# EAGLE design L298N (EAGLE 6.1)
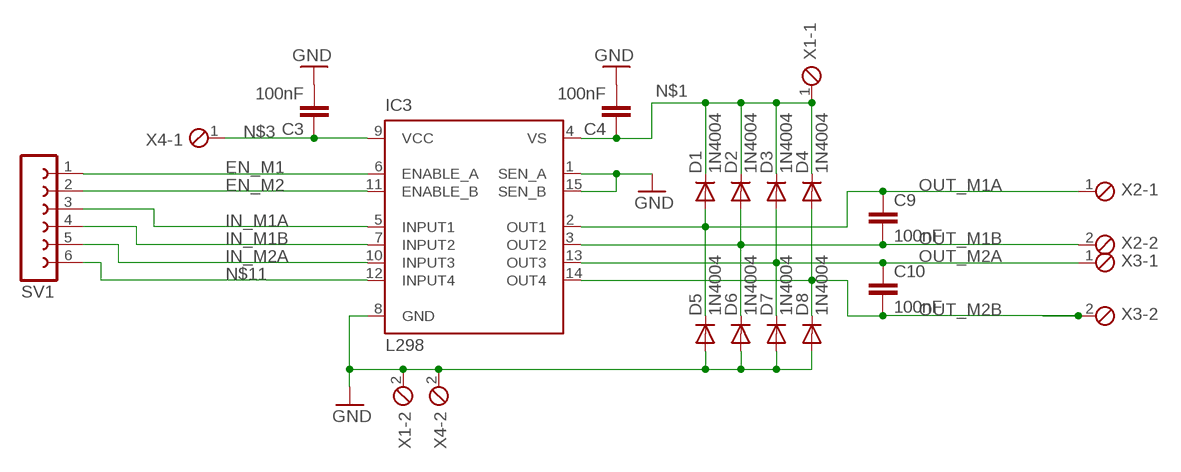
[diagram p0: schematic, sheet 1]

## Parts
C3  100nF  C-EU050-050X075  [C050-050X075]
C4  100nF  C-EU050-050X075  [C050-050X075]
C9  100nF  C-EU050-050X075  [C050-050X075]
C10  100nF  C-EU050-050X075  [C050-050X075]
D1  1N4004  [DO41-10]
D2  1N4004  [DO41-10]
D3  1N4004  [DO41-10]
D4  1N4004  [DO41-10]
D5  1N4004  [DO41-10]
D6  1N4004  [DO41-10]
D7  1N4004  [DO41-10]
D8  1N4004  [DO41-10]
IC3  L298  [MULTIWATT-15]
SV1  FE06-1  [FE06]
X1  MPT2  [2POL254]
X2  MPT2  [2POL254]
X3  MPT2  [2POL254]
X4  MPT2  [2POL254]

## Nets
EN_M1: IC3.6(ENABLE_A) SV1.1
EN_M2: IC3.11(ENABLE_B) SV1.2
GND: C3.2 C4.2 D5.A D6.A D7.A D8.A IC3.1(SEN_A) IC3.8(GND) IC3.15(SEN_B) X1.2 X4.2
IN_M1A: IC3.5(INPUT1) SV1.3
IN_M1B: IC3.7(INPUT2) SV1.4
IN_M2A: IC3.10(INPUT3) SV1.5
N$1: C4.1 D1.C D2.C D3.C D4.C IC3.4(VS) X1.1
N$3: C3.1 IC3.9(VCC) X4.1
N$11: IC3.12(INPUT4) SV1.6
OUT_M1A: C9.1 D1.A D5.C IC3.2(OUT1) X2.1
OUT_M1B: C9.2 D2.A D6.C IC3.3(OUT2) X2.2
OUT_M2A: C10.1 D3.A D7.C IC3.13(OUT3) X3.1
OUT_M2B: C10.2 D4.A D8.C IC3.14(OUT4) X3.2

## Library data of the parts
C3 C4 C9 C10 = resistor:C-EU: CAPACITOR, European symbol
D1-D8 = diode:1N4004: DIODE general purpose rectifier, 1 A
IC3 = st-microelectronics:L298: DUAL FULL-BRIDGE DRIVER; MPN: L298N; OC_FARNELL: 1589425; OC_NEWARK: 32M1527
SV1 = con-lsta:FE06-1: FEMALE HEADER; OC_FARNELL: unknown; OC_NEWARK: unknown
X1-X4 = con-phoenix-254:MPT2: PHOENIX CONNECTOR; OC_FARNELL: unknown; OC_NEWARK: unknown

## Board
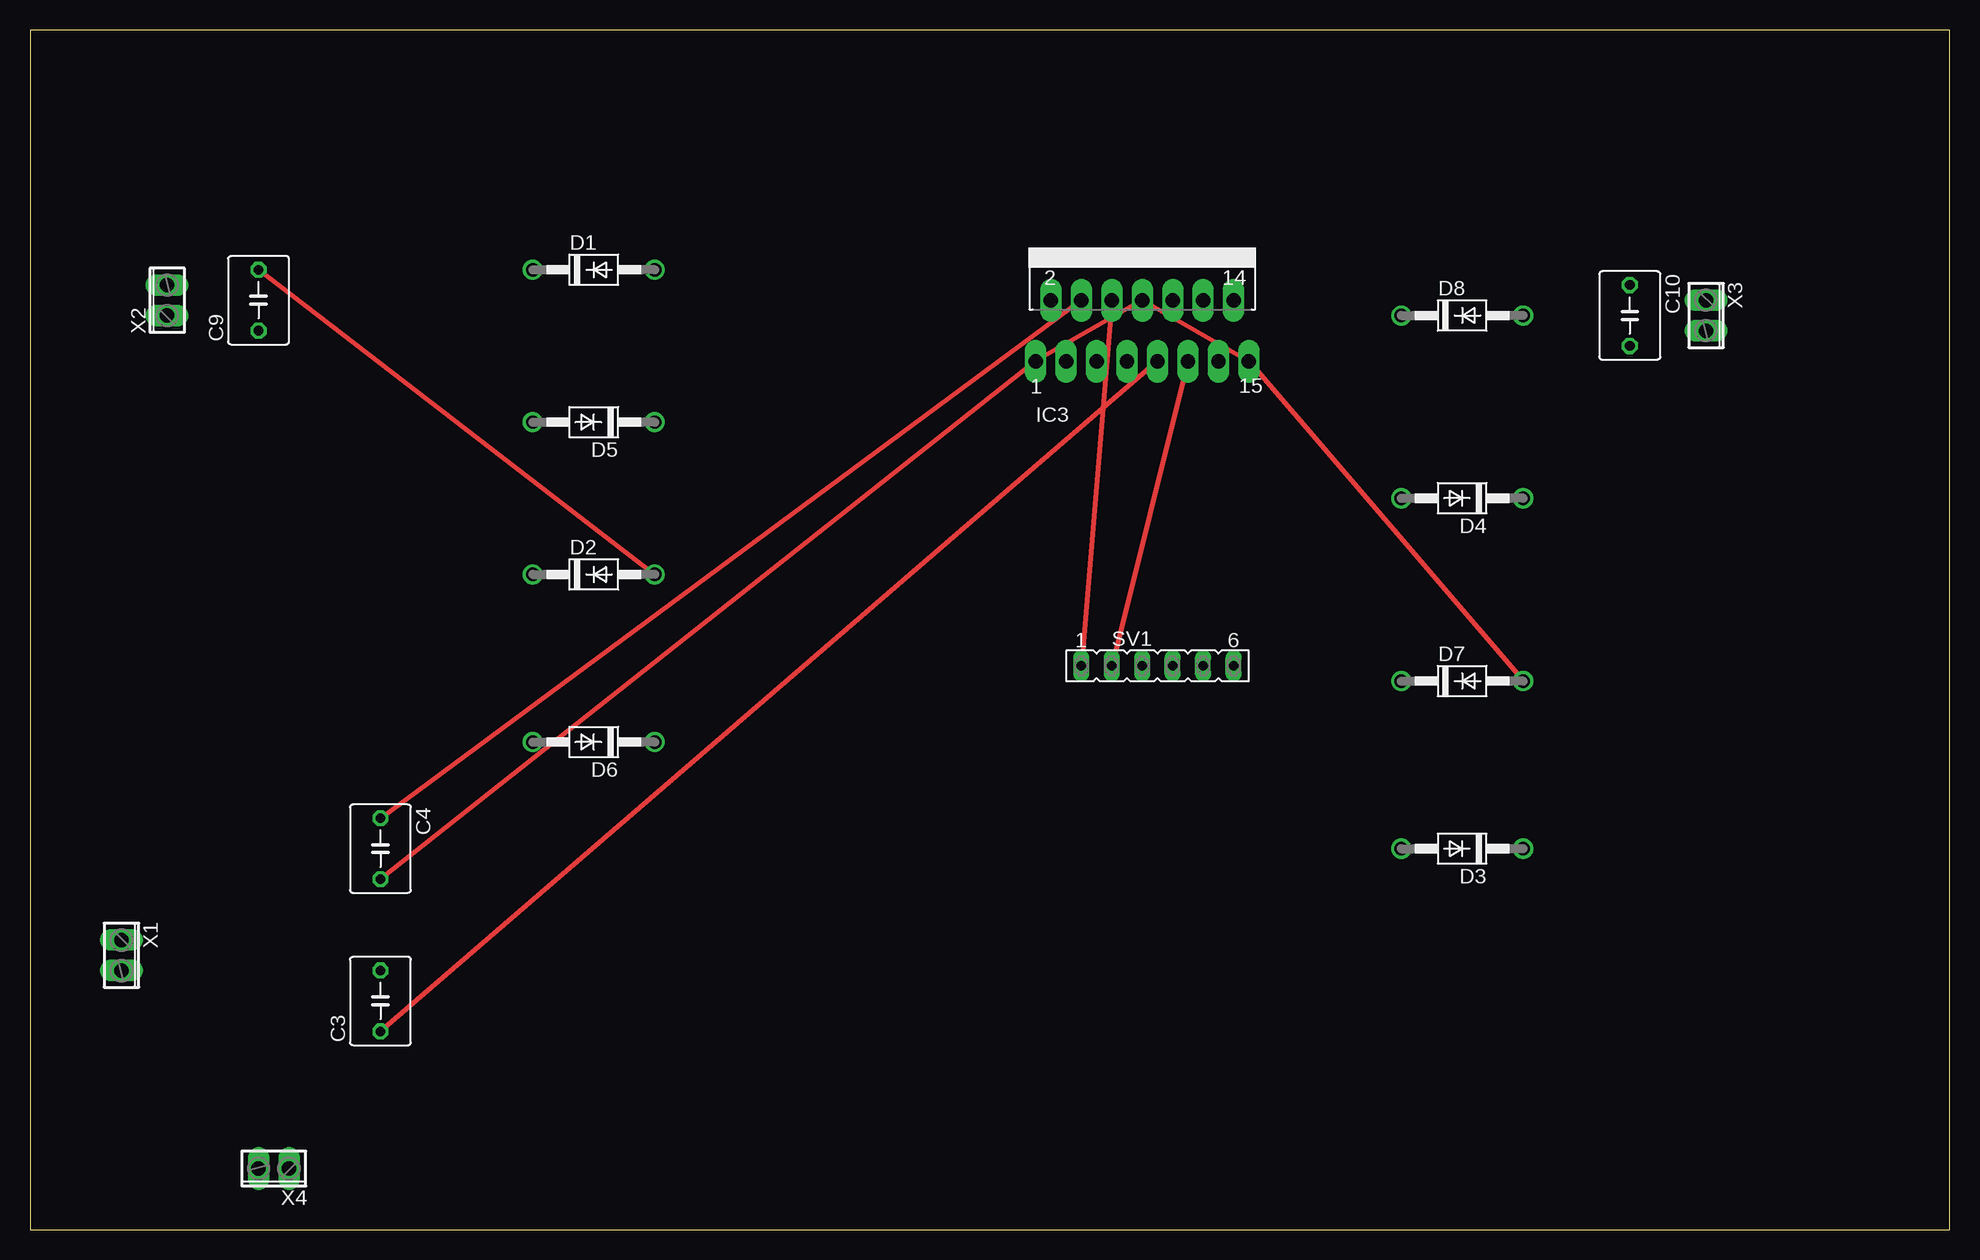
[diagram p1: board, top side]
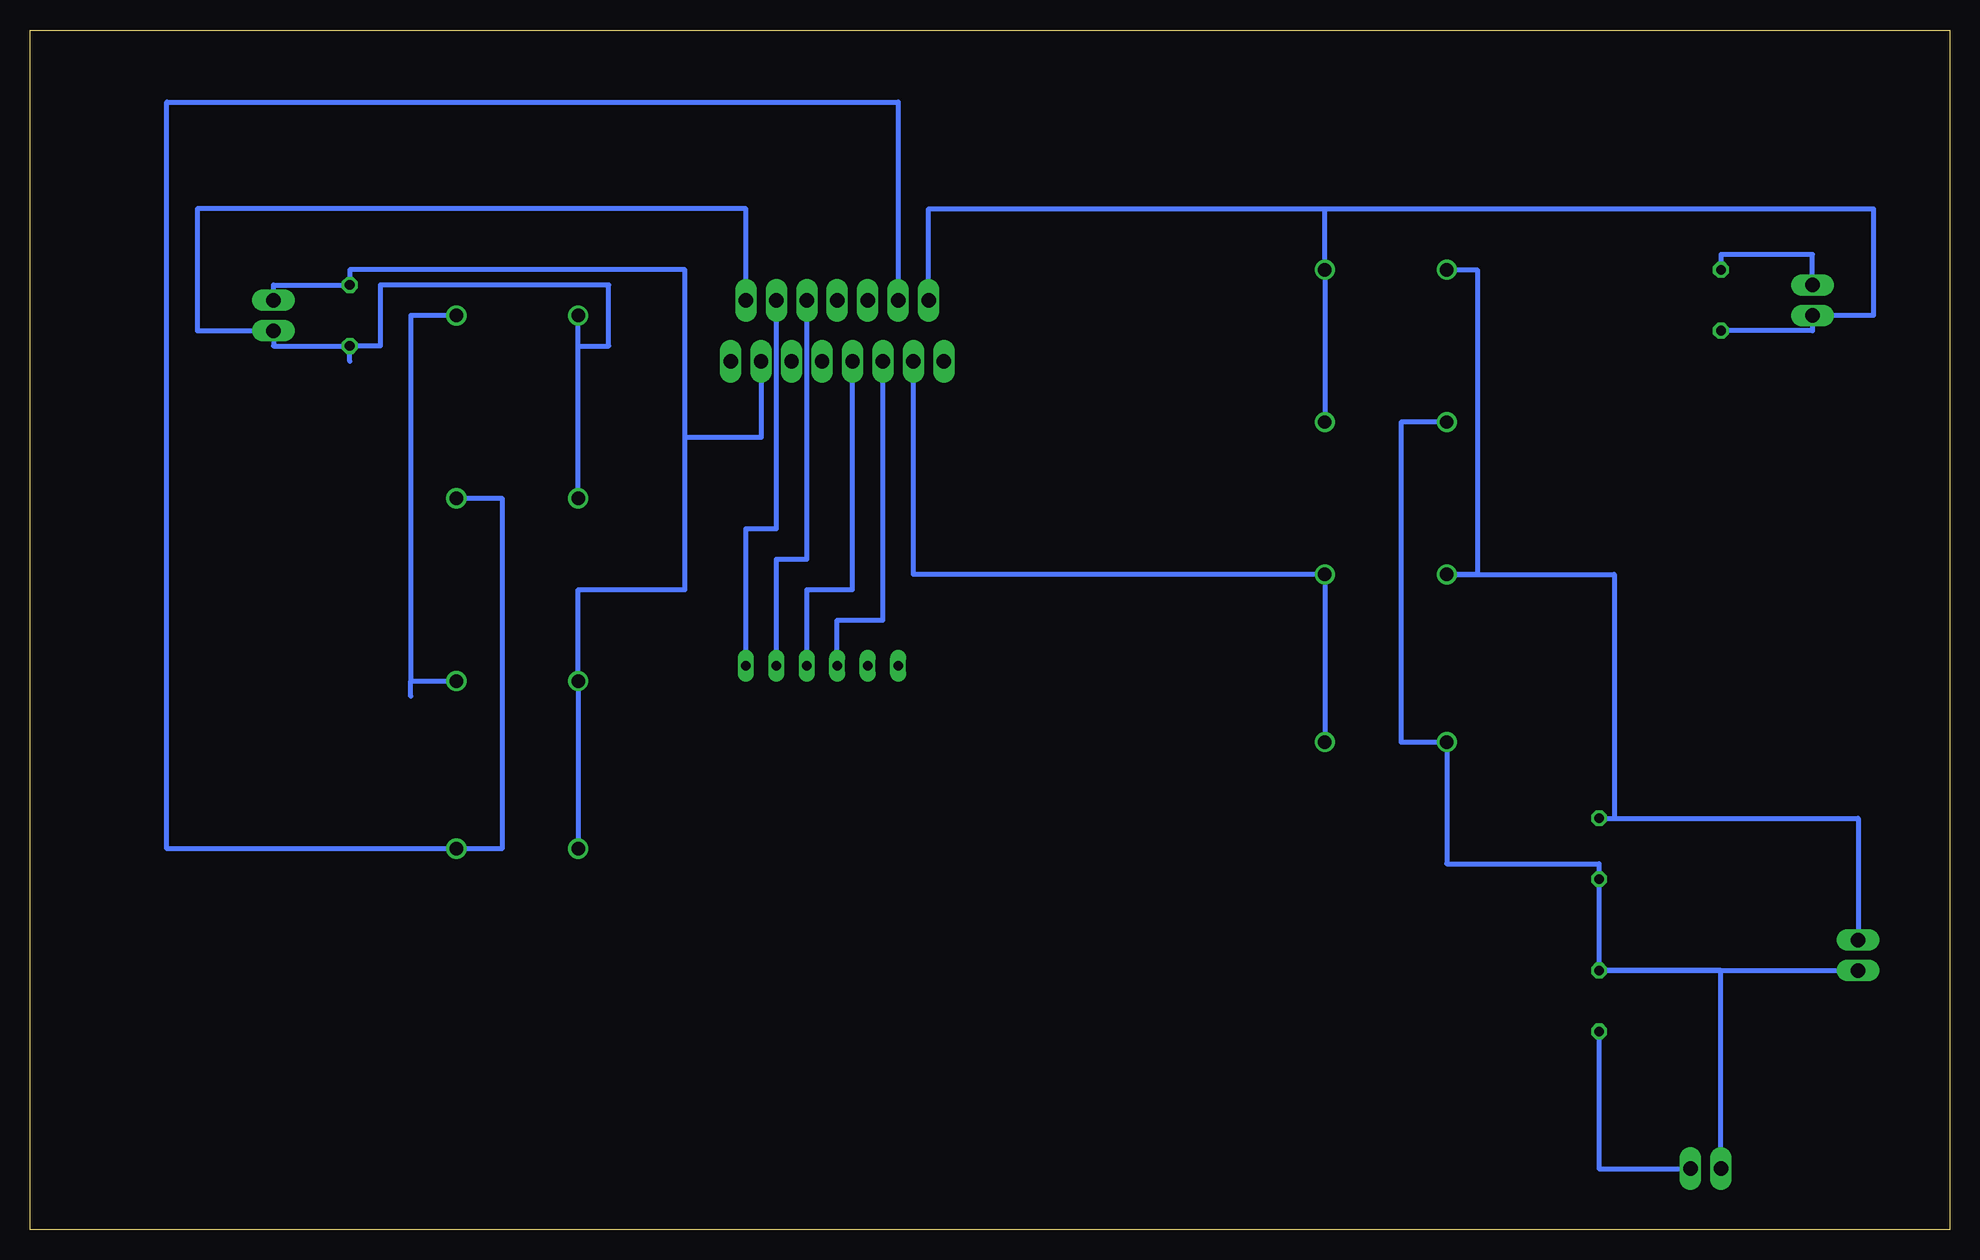
[diagram p2: board, bottom side, seen from below]

Size 160 x 100 mm. Coordinates in mm from the lower left corner, seen from the top.
Outline: 0,0 160,0 160,100 0,100 0,0
Copper layers (1*16): Top 0.035mm / dielectric 1.5mm / Bottom 0.035mm
Design rules: minimum track width 10mil, minimum drill 24mil, track to track 8mil, track to pad 8mil, pad to pad 8mil, via to via 8mil, smd to smd 8mil, copper to edge 40mil, drill to drill 8mil, minimum pad ring 10mil, minimum via ring 8mil, stop-mask expansion 4mil, vias tented up to drill 0mil, thermal gap 10mil

### Footprints (pad centres in the part's own frame; a part is rotated, then mirrored left to right if it is on the bottom)
C050-050X075 = drill 0.813 octagon: 1 -2.54,0; 2 2.54,0
DO41-10 = drill 1.118: A 5.08,0; C -5.08,0
MULTIWATT-15 = drill 1.2 long: 1 -8.89,-7.62; 2 -7.62,-2.54; 3 -6.35,-7.62; 4 -5.08,-2.54; 5 -3.81,-7.62; 6 -2.54,-2.54; 7 -1.27,-7.62; 8 0,-2.54; 9 1.27,-7.62; 10 2.54,-2.54; 11 3.81,-7.62; 12 5.08,-2.54; 13 6.35,-7.62; 14 7.62,-2.54; 15 8.89,-7.62
FE06 = drill 0.813 long: 1 -6.35,0; 2 -3.81,0; 3 -1.27,0; 4 1.27,0; 5 3.81,0; 6 6.35,0
2POL254 = drill 1.2 long: 1 -1.27,0; 2 1.27,0

### Placement (x,y rotation side)
C3  29.21,19.05 90 top
C4  29.21,31.75 270 top
C9  19.05,77.47 90 top
C10  133.35,76.2 270 top
D1  46.99,80.01 0 top
D2  46.99,54.61 0 top
D3  119.38,31.75 180 top
D4  119.38,60.96 180 top
D5  46.99,67.31 180 top
D6  46.99,40.64 180 top
D7  119.38,45.72 0 top
D8  119.38,76.2 0 top
IC3  92.71,80.01 0 top
SV1  93.98,46.99 0 top
X1  7.62,22.86 270 top
X2  11.43,77.47 90 top
X3  139.7,76.2 270 top
X4  20.32,5.08 180 top

### Tracks (layer width: path | path; a pad name or v marks a point on that pad's centre or on a via)
EN_M1
  Top 0.406: IC3.6 SV1.1
EN_M2
  Top 0.406: IC3.11 SV1.2
GND
  Top 0.406: C4.2 IC3.1 IC3.8 IC3.15 D7.A
  Bottom 0.406: X4.2 19.05,21.59 C3.2 | C3.2 C4.2 29.21,30.48 41.91,30.48 D6.A 45.72,40.64 45.72,67.31 D5.A | C3.2 X1.2 | D8.A 128.27,76.2 128.27,45.72 | 128.27,44.45 128.27,45.72 | 128.27,45.72 D7.A
IN_M1A
  Bottom 0.406: SV1.3 92.71,50.8 88.9,50.8 IC3.5
IN_M1B
  Bottom 0.406: SV1.4 95.25,53.34 91.44,53.34 IC3.7
IN_M2A
  Bottom 0.406: SV1.5 97.79,55.88 95.25,55.88 IC3.10
N$1
  Top 0.406: IC3.4 C4.1
  Bottom 0.406: C4.1 27.94,34.29 | 27.94,34.29 7.62,34.29 X1.1 | D1.C 39.37,80.01 39.37,54.61 D2.C 27.94,54.61 27.94,34.29 | D4.C 120.65,60.96 120.65,31.75 D3.C 148.59,31.75 148.59,93.98 87.63,93.98 IC3.4
N$3
  Top 0.406: IC3.9 C3.1
  Bottom 0.406: C3.1 29.21,5.08 X4.1
N$11
  Bottom 0.406: SV1.6 100.33,58.42 97.79,58.42 IC3.12
OUT_M1A
  Bottom 0.406: IC3.2 85.09,85.09 52.07,85.09 | 52.07,85.09 6.35,85.09 6.35,76.2 X2.1 11.43,74.93 C9.1 | D5.C D1.A 52.07,85.09
OUT_M1B
  Top 0.406: C9.2 D2.A
  Bottom 0.406: X2.2 11.43,81.28 19.05,81.28 C9.2 | D6.C D2.A 86.36,54.61 IC3.3
OUT_M2A
  Bottom 0.406: D3.A D7.C 114.3,53.34 105.41,53.34 105.41,66.04 | X3.1 139.7,78.74 C10.1 133.35,80.01 105.41,80.01 105.41,66.04 | IC3.13 99.06,66.04 105.41,66.04
OUT_M2B
  Bottom 0.406: IC3.14 100.33,85.09 146.05,85.09 146.05,74.93 X3.2 139.7,73.66 C10.2 | D4.A 114.3,73.66 | 114.3,73.66 D8.C | 133.35,72.39 C10.2 | 114.3,73.66 111.76,73.66 111.76,78.74 130.81,78.74 130.81,73.66 C10.2